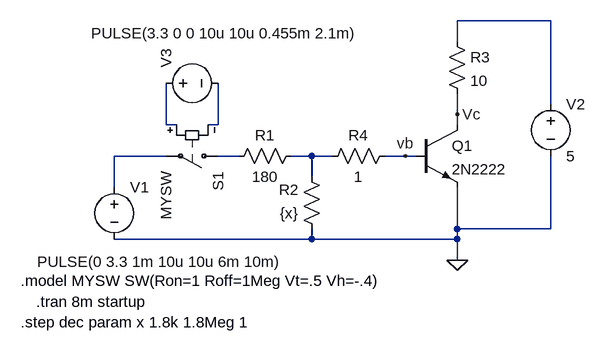
[diagram p0: schematic NPN_switch.asc]
NPN_switch.asc, the LTspice schematic file:
Version 4
SHEET 1 880 680
WIRE 544 -64 400 -64
WIRE 400 -32 400 -64
WIRE 544 64 544 -64
WIRE 400 80 400 48
WIRE -48 96 -48 32
WIRE -32 96 -48 96
WIRE 32 96 32 32
WIRE 32 96 16 96
WIRE 400 96 400 80
WIRE -48 144 -128 144
WIRE 64 144 32 144
WIRE 176 144 144 144
WIRE 208 144 176 144
WIRE 320 144 288 144
WIRE 336 144 320 144
WIRE 176 176 176 144
WIRE -128 192 -128 144
WIRE 400 256 400 192
WIRE 544 256 544 144
WIRE 544 256 400 256
WIRE 176 272 176 256
WIRE 176 272 -128 272
WIRE 400 272 400 256
WIRE 400 272 176 272
WIRE 400 304 400 272
FLAG 400 304 0
FLAG 400 80 Vc
FLAG 320 144 vb
SYMBOL res 160 128 R90
WINDOW 0 0 56 VBottom 2
WINDOW 3 32 56 VTop 2
SYMATTR InstName R1
SYMATTR Value 180
SYMBOL res 192 272 R180
WINDOW 0 36 76 Left 2
WINDOW 3 36 40 Left 2
SYMATTR InstName R2
SYMATTR Value {x}
SYMBOL npn 336 96 R0
SYMATTR InstName Q1
SYMATTR Value 2N2222
SYMBOL res 384 -48 R0
SYMATTR InstName R3
SYMATTR Value 10
SYMBOL voltage -128 176 R0
WINDOW 3 -119 131 Left 2
WINDOW 123 0 0 Left 0
WINDOW 39 0 0 Left 0
SYMATTR Value PULSE(0 3.3 1m 10u 10u 6m 10m)
SYMATTR InstName V1
SYMBOL voltage 544 48 R0
WINDOW 123 0 0 Left 0
WINDOW 39 0 0 Left 0
SYMATTR InstName V2
SYMATTR Value 5
SYMBOL sw 48 144 R90
SYMATTR InstName S1
SYMATTR Value MYSW
SYMBOL voltage -64 32 R270
WINDOW 3 77 -100 VRight 2
WINDOW 123 0 0 Left 0
WINDOW 39 0 0 Left 0
SYMATTR Value PULSE(3.3 0 0 10u 10u 0.455m 2.1m)
SYMATTR InstName V3
SYMBOL res 304 128 R90
WINDOW 0 0 56 VBottom 2
WINDOW 3 32 56 VTop 2
SYMATTR InstName R4
SYMATTR Value 1
TEXT -248 368 Left 2 !.tran 8m startup
TEXT -272 336 Left 2 !.model MYSW SW(Ron=1 Roff=1Meg Vt=.5 Vh=-.4)
TEXT -272 400 Left 2 !.step dec param x 1.8k 1.8Meg 1

The netlist it stands for:
* NPN_switch.asc
R1 N006 N005 180
R2 0 N006 {x}
Q1 Vc vb 0 0 2N2222
R3 N001 Vc 10
V1 N004 0 PULSE(0 3.3 1m 10u 10u 6m 10m)
V2 N001 0 5
S1 N005 N004 N002 N003 MYSW
V3 N002 N003 PULSE(3.3 0 0 10u 10u 0.455m 2.1m)
R4 vb N006 1
.model NPN NPN
.model PNP PNP
.lib standard.bjt
.tran 8m startup
.model MYSW SW(Ron=1 Roff=1Meg Vt=.5 Vh=-.4)
.step dec param x 1.8k 1.8Meg 1
.backanno
.end

* Results of the author's LTspice run, read from the files saved beside the schematic
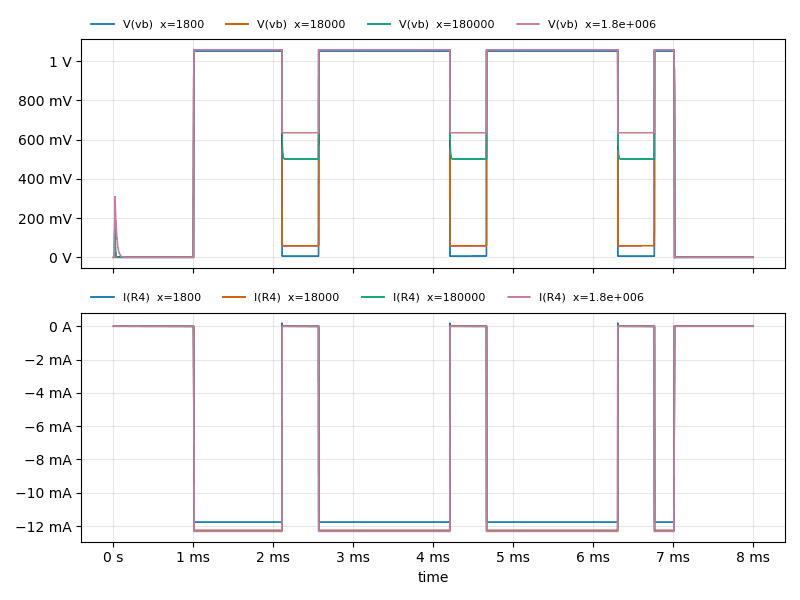
[diagram p1: Transient Analysis of NPN_switch.asc, plotted from the saved traces]
* Transient Analysis, 4 runs:
*   V(vb) [x=1800]: min -68.83 µV, max 1.053 V, average 611.9 mV, rms 801.6 mV, last 0 V
*   V(vb) [x=18000]: min 0 V, max 1.058 V, average 624.2 mV, rms 806.1 mV, last 0 V
*   V(vb) [x=180000]: min -51.39 µV, max 1.058 V, average 700.8 mV, rms 832.6 mV, last 0 V
*   V(vb) [x=1.8e+006]: min -3.894 mV, max 1.058 V, average 724.3 mV, rms 848.1 mV, last 0 V
*   I(R4) [x=1800]: min -11.76 mA, max 183.9 µA, average -6.809 mA, rms 8.945 mA, last 0 A
*   I(R4) [x=18000]: min -12.26 mA, max 24.94 µA, average -7.099 mA, rms 9.326 mA, last 0 A
*   I(R4) [x=180000]: min -12.31 mA, max 24.33 µA, average -7.128 mA, rms 9.364 mA, last 0 A
*   I(R4) [x=1.8e+006]: min -12.32 mA, max 12.25 µA, average -7.131 mA, rms 9.368 mA, last 0 A